# Altium schematic sheet Cell.SchDoc
size A; SheetNumber: 5
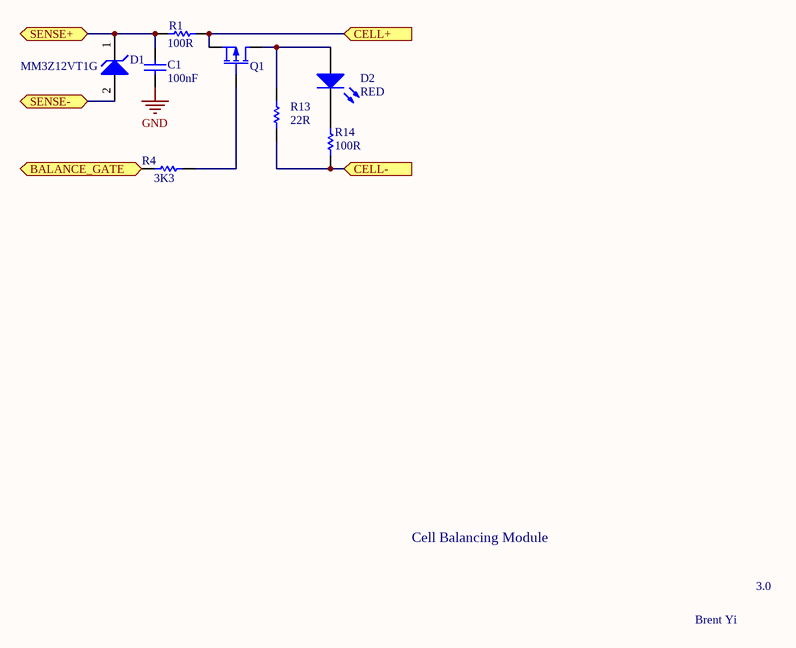
[diagram p0: Cell.SchDoc]

## Parts
C1  100nF  [CAPC0603(1608)100_M]
D1  MM3Z12VT1G  [ONSC-SOD-323-2-477-02_V]
D2  RED  [0603_A]
Q1  SI2365  [SOT23-3]  (value not drawn)
R1  100R  [RESC0603(1608)_N]
R4  3K3  [RESC0603(1608)_N]
R13  value 22R  [RESC2512(6432)_N]
R14  100R  [RESC0603(1608)_N]

## Ports
BALANCE_GATE (in), CELL+ (in), CELL- (in), SENSE+, SENSE- (bidir)

## Nets
GND: C1.2
BALANCE_GATE: R4.1 ; port BALANCE_GATE
CELL+: Q1.3(S) R1.2 ; port CELL+
CELL-: R13.2 R14.1 ; port CELL-
SENSE+: C1.1 D1.1(K) R1.1 ; port SENSE+
SENSE-: D1.2(A) ; port SENSE-
NetD2_1: D2.1(K) R14.2
NetD2_2: D2.2(A) Q1.2(D) R13.1
NetQ1_1: Q1.1(G) R4.2

## Notes on the sheet
- Cell Balancing Module
- 3.0
- Brent Yi

## Library data of the parts
C1 = CMP-1035-02575-1: CAP 100nF 6.3V Â±5% 0603 (1608 Metric) Thickness 1mm SMD; Case-Metric: 1608; Case-EIA: 0603; Tolerance: Â±5%; Technology: SMT; Rated Voltage: 6.3 V; Max Thickness: 1 mm; Value: 100nF
D1 = CMP-1060-00726-1: Zener Voltage Regulator, 300 mW, 2-Pin SOD-323, Tape and Reel; Manufacturer: On Semiconductor; VZ Typ (V): 12; P Max (W): 0.3; Packing: Tape and Reel; ComponentLink3URL: http://www.onsemi.com/pub_link/Collateral/477-02.PDF.1; ComponentLink2Description: Datasheet; Mounting Technology: Surface Mount; PackageVersion: Rev. H, 03/2007; PackageDescription: 2-Pin SOD, Body 1.7 x 1.25 mm; ComponentLink1URL: http://www.onsemi.com/; ComponentLink1Description: Manufacturer URL; PartNumber: MM3Z12VT1; ComponentLink3Description: Package Specification; ComponentLink2URL: http://www.onsemi.cn/pub_link/Collateral/MM3Z2V4T1-D.PDF; DatasheetVersion: Rev. 9; PackageReference: SOD-323-2-477-02
D2 = CMP-1426-00001-1: SMD mono-color Chip LED, WL-SMCW, Red; Manufacturer: Wuerth Elektronik; PartNumber: 150060RS75000; Color: Red; PackageReference: 0603_A; ComponentLink2URL: http://katalog.we-online.com/led/datasheet/150060RS75000.pdf; ComponentLink1URL: http://www.we-online.com; ComponentLink1Description: Manufacturer URL; ComponentLink2Description: Datasheet
Q1 = MOSFET-P: P-Channel MOSFET; Published: 8-Jun-2000; LatestRevisionDate: 17-Jul-2002; LatestRevisionNote: Re-released for DXP Platform.; PackageVersion: 1995/1996; PackageReference: E3; Publisher: Altium Limited; PackageDescription: TO, Flat Index; 3 In-Line, Axial Leads; Body Dia. 4.6mm; Lead Dia. 0.5 mm (max)
R1 R14 = CMP-1012-00050-1: 100R 0.1W 5% 0603 (1608 Metric)  SMD; Case-EIA: 0603; Value: 100.00 Ohm; Case-Metric: 1608; Tolerance: 5 %; Technology: SMT; Power: 0.1 W
R4 = CMP-1012-00086-1: 3K3 0.1W 5% 0603 (1608 Metric)  SMD; Case-EIA: 0603; Value: 3300.00 Ohm; Case-Metric: 1608; Technology: SMT; Tolerance: 5 %; Power: 0.1 W
R13 = CMP-1018-00014-1: 10R 1W 5% 2512 (6432 Metric)  SMD; Case-EIA: 2512; Case-Metric: 6432; Tolerance: 5 %; Technology: SMT; Power: 1 W